# EAGLE design Thermocouple_Amplifier_K (EAGLE 9.6.1)
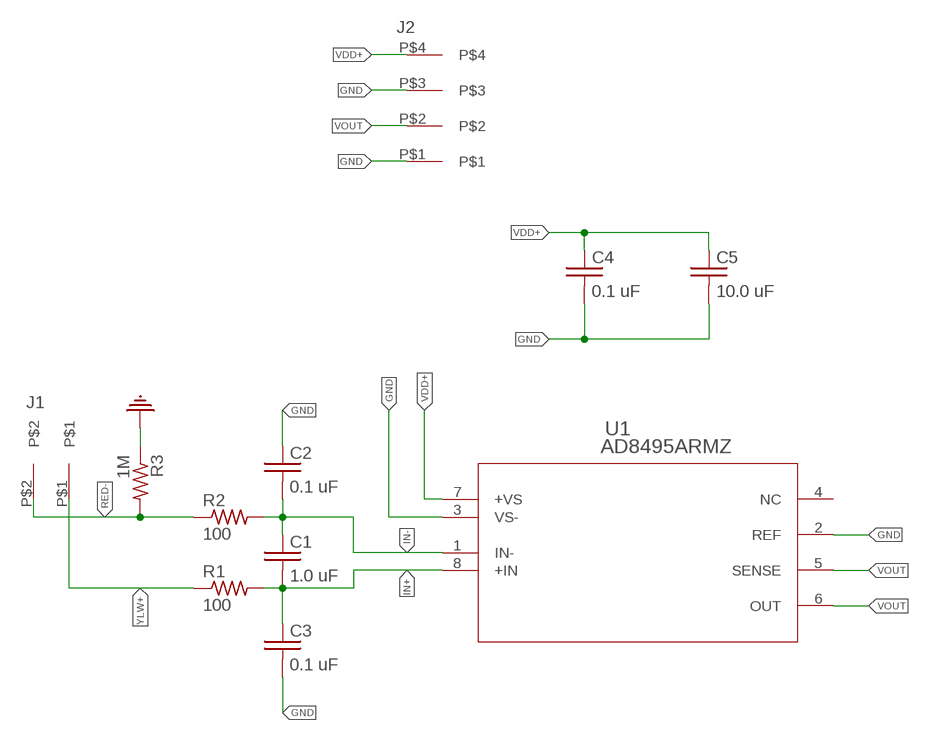
[diagram p0: schematic, sheet 1]

## Parts
C1  1.0 uF  C_0402  [0402]
C2  0.1 uF  C_0402  [0402]
C3  0.1 uF  C_0402  [0402]
C4  0.1 uF  C_0402  [0402]
C5  10.0 uF  C_0402  [0402]
J1  3.81MM_1_X_2_RT_ANGLE_PLUG_HEADER  [2_3.81MM_PITCH]
J2  3.81MM_1_X_4_RT_ANGLE_PLUG_HEADER  [1X4_3.81MM_PITCH]
R1  100  R_0402  [0402]
R2  100  R_0402  [0402]
R3  1M  R_0402  [0402]
U1  AD8495ARMZ  [RM_8_ADI]

## Nets
GND: C2.P$1 C3.P$2 C4.P$2 C5.P$2 J2.P$1 J2.P$3 R3.P$1 U1.2(REF) U1.3(VS-)
IN+: C1.P$2 C3.P$1 R1.P$2 U1.8(+IN)
IN-: C1.P$1 C2.P$2 R2.P$2 U1.1(IN-)
RED-: J1.P$2 R2.P$1 R3.P$2
VDD+: C4.P$1 C5.P$1 J2.P$4 U1.7(+VS)
VOUT: J2.P$2 U1.5(SENSE) U1.6(OUT)
YLW+: J1.P$1 R1.P$1
Unconnected: U1.4(NC)

## Library data of the parts
C1-C5 = 3D_MIG_Controller:C_0402
J1 = 3D_MIG_Controller:3.81MM_1_X_2_RT_ANGLE_PLUG_HEADER
J2 = 3D_MIG_Controller:3.81MM_1_X_4_RT_ANGLE_PLUG_HEADER
R1-R3 = 3D_MIG_Controller:R_0402
U1 = 3D_MIG_Controller:AD8495ARMZ; BUILT_BY: EMA_UL_Team; MANUFACTURER_PART_NUMBER: AD8495ARMZ; SOURCELIBRARY: Analog_2015-12-15; VENDOR: Analog Devices Inc

## Board
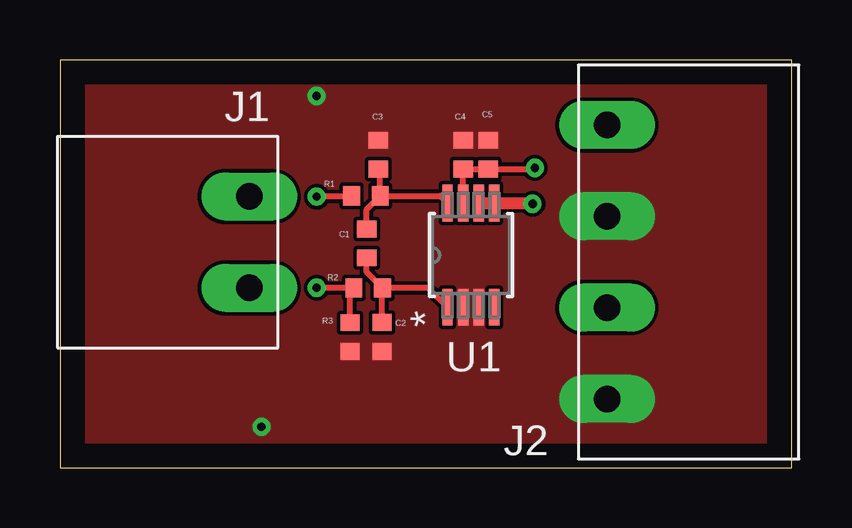
[diagram p1: board, top side]
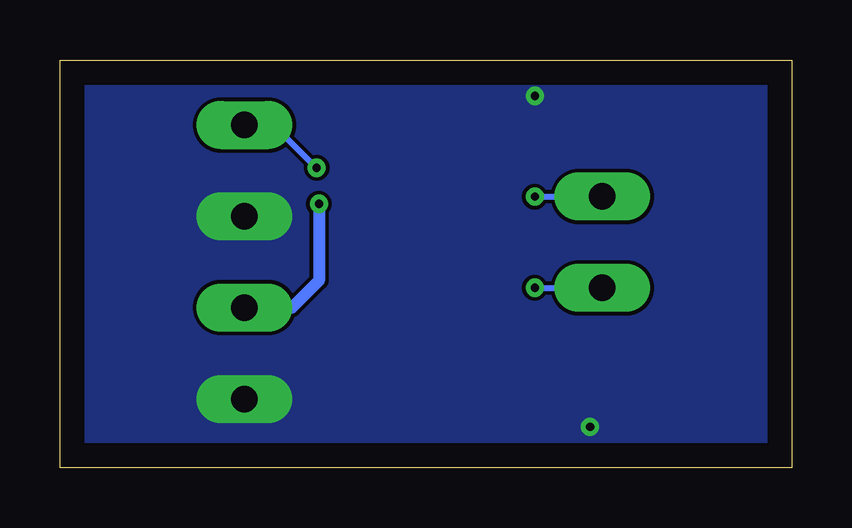
[diagram p2: board, bottom side, seen from below]

Size 30.5 x 17 mm. Coordinates in mm from the lower left corner, seen from the top.
Outline: 0,0 30.5,0 30.5,17 0,17 0,0
Copper layers (1*16): Top 0.035mm / dielectric 1.5mm / Bottom 0.035mm
Design rules "default": minimum track width 6mil, minimum drill 0.35mm, track to track 6mil, track to pad 6mil, pad to pad 6mil, via to via 6mil, smd to smd 6mil, copper to edge 40mil, drill to drill 6mil, minimum pad ring 10mil, minimum via ring 8mil, stop-mask expansion 4mil, vias tented up to drill 0mil, thermal gap 10mil

### Footprints (pad centres in the part's own frame; a part is rotated, then mirrored left to right if it is on the bottom)
0402 = smd 0.8 x 0.7: P$1 0,0.6; P$2 0,-0.6
2_3.81MM_PITCH = drill 1.1 pad 2 long: P$1 0,0; P$2 3.81,0
1X4_3.81MM_PITCH = drill 1.1 pad 2 long: P$1 0,0; P$2 3.81,0; P$3 7.62,0; P$4 11.43,0
RM_8_ADI = smd 1.524 x 0.432: 1 -2.172,0.975; 2 -2.172,0.325; 3 -2.172,-0.325; 4 -2.172,-0.975; 5 2.172,-0.975; 6 2.172,-0.325; 7 2.172,0.325; 8 2.172,0.975

### Placement (x,y rotation side)
C1  12.79,9.35 180 top
C2  13.43,5.45 180 top
C3  13.27,13.05 180 top
C4  16.81,13.05 180 top
C5  17.85,13.05 180 top
J1  7.89,11.31 270 top
J2  22.81,2.86 90 top
R1  12.75,11.33 90 top
R2  12.85,7.49 90 top
R3  12.09,5.44 180 top
U1  17.13,8.86 90 top

### Tracks (layer width: path | path; a pad name or v marks a point on that pad's centre or on a via)
GND  (via drill 0.35)
  other vias: 10.7,15.5 8.4,1.7
  pour Top (no thermals): 30.5,17 30.5,0 0,0 0,17
  pour Bottom (no thermals): 0,17 30.5,17 30.5,0 0,0
IN+
  Top 0.254: R1.P$2 15.86,11.33 U1.8 | C1.P$2 12.79,10.77 R1.P$2 | R1.P$2 13.35,12.37 C3.P$1
IN-
  Top 0.254: U1.1 15.35,7.49 R2.P$2 | R2.P$2 12.79,8.15 C1.P$1 | C2.P$2 13.43,7.47 R2.P$2
RED-  (via drill 0.35)
  Top 0.254: R3.P$2 12.09,7.33 R2.P$1 v10.71,7.49 v10.7,7.5
  Bottom 0.254: v10.7,7.5 J1.P$2
VDD+  (via drill 0.35)
  Top 0.254: U1.7 C4.P$1 C5.P$1 19.75,12.45 v19.8,12.5
  Bottom 0.254: v19.8,12.5 21.59,14.29 J2.P$4
VOUT  (via drill 0.35)
  Top 0.508: U1.6 U1.5 19.67,11.03 v19.7,11
  Bottom 0.508: v19.7,11 19.7,7.8 20.83,6.67 J2.P$2
YLW+  (via drill 0.35)
  Top 0.254: 12.13,11.31 R1.P$1 12.12,11.3 v10.7,11.3
  Bottom 0.254: v10.7,11.3 J1.P$1